# EAGLE design nanonode-xmega-mc-headers (EAGLE 5.10)
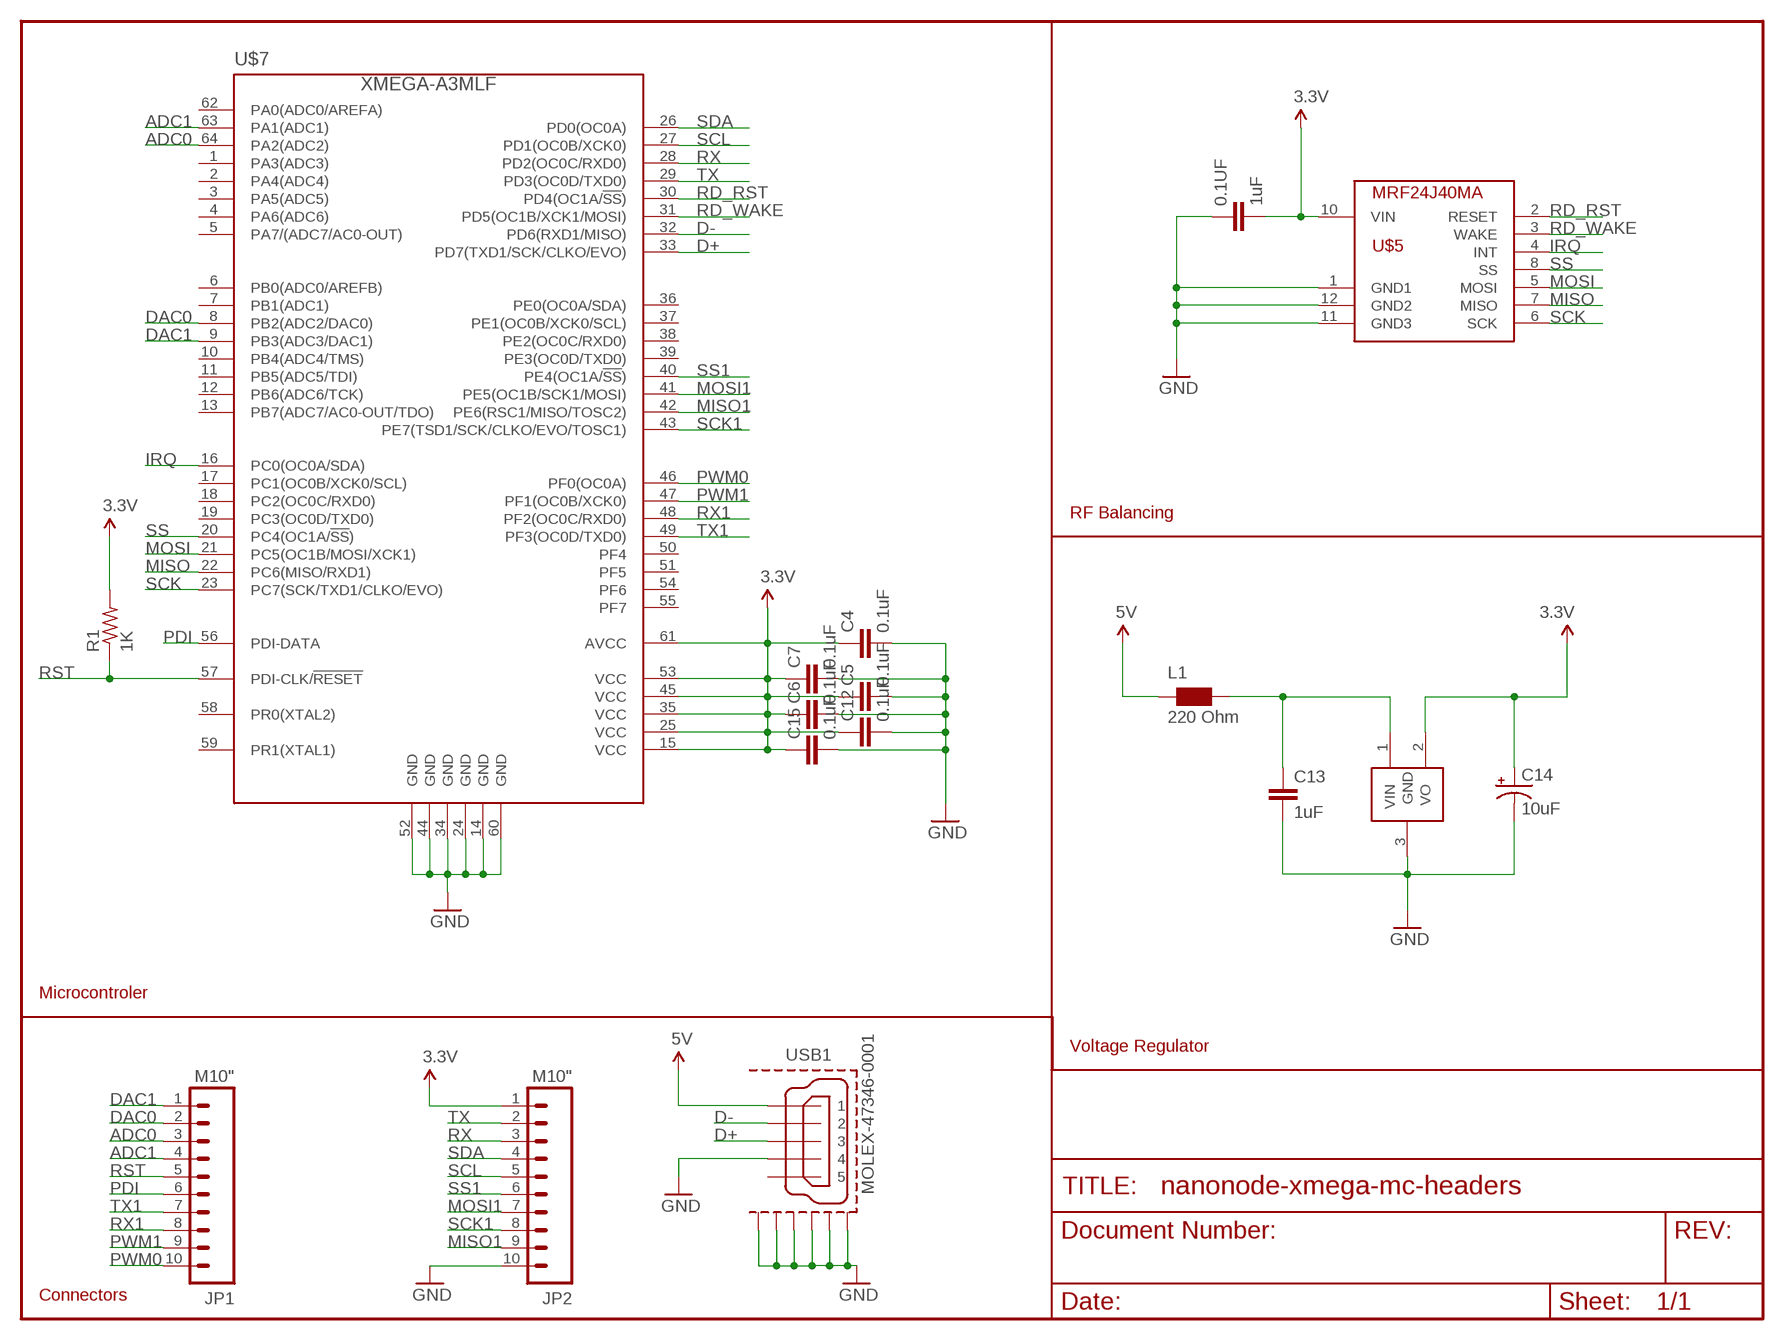
[diagram p0: schematic, sheet 1]

## Parts
0.1UF  1uF  C-EUC0603  [C0603]
C4  0.1uF  C-EUC0603  [C0603]
C5  0.1uF  C-EUC0603  [C0603]
C6  0.1uF  C-EUC0603  [C0603]
C7  0.1uF  C-EUC0603  [C0603]
C12  0.1uF  C-EUC0603  [C0603]
C13  1uF  C-EUC0603  [C0603]
C14  10uF  CAP_POL1206  [EIA3216]
C15  0.1uF  C-EUC0603  [C0603]
JP1  M10"  [1X10]
JP2  M10"  [1X10]
L1  220 Ohm  WE-CBF_0603  [0603]
R1  1K  R-US_R0402  [R0402]
U$4  MCP1700  [SOT23-3]
U$5  MRF24J40MA  [MRF24J40MA]
U$7  XMEGA-A3MLF  [MLF64]
USB1  MOLEX-47346-0001  [MOLEX-47364-0001]

## Nets
3.3V: 0.1UF.2 C4.1 C5.1 C6.1 C7.1 C12.1 C14.A(+) C15.1 JP2.1 R1.2 U$4.2(VO) U$5.10(VIN) U$7.15(VCC) U$7.25(VCC) U$7.35(VCC) U$7.45(VCC) U$7.53(VCC) U$7.61(AVCC)
5V: L1.1 USB1.1
ADC0: JP1.3 U$7.64(PA2(ADC2))
ADC1: JP1.4 U$7.63(PA1(ADC1))
D+: U$7.33(PD7(TXD1/SCK/CLKO/EVO)) USB1.3
D-: U$7.32(PD6(RXD1/MISO)) USB1.2
DAC0: JP1.2 U$7.8(PB2(ADC2/DAC0))
DAC1: JP1.1 U$7.9(PB3(ADC3/DAC1))
GND: 0.1UF.1 C4.2 C5.2 C6.2 C7.2 C12.2 C13.2 C14.C(-) C15.2 JP2.10 U$4.3(GND) U$5.1(GND1) U$5.11(GND3) U$5.12(GND2) U$7.14(GND) U$7.24(GND) U$7.34(GND) U$7.44(GND) U$7.52(GND) U$7.60(GND) USB1.4 USB1.GND1 USB1.GND2 USB1.GND3 USB1.GND4 USB1.GND5 USB1.GND6
IRQ: U$5.4(INT) U$7.16(PC0(OC0A/SDA))
MISO: U$5.7(MISO) U$7.22(PC6(MISO/RXD1))
MISO1: JP2.9 U$7.42(PE6(RSC1/MISO/TOSC2))
MOSI: U$5.5(MOSI) U$7.21(PC5(OC1B/MOSI/XCK1))
MOSI1: JP2.7 U$7.41(PE5(OC1B/SCK1/MOSI))
N$13: C13.1 L1.2 U$4.1(VIN)
PDI: JP1.6 U$7.56(PDI-DATA)
PWM0: JP1.10 U$7.46(PF0(OC0A))
PWM1: JP1.9 U$7.47(PF1(OC0B/XCK0))
RD_RST: U$5.2(RESET) U$7.30(PD4(OC1A/!SS!))
RD_WAKE: U$5.3(WAKE) U$7.31(PD5(OC1B/XCK1/MOSI))
RST: JP1.5 R1.1 U$7.57(PDI-CLK/!RESET)
RX: JP2.3 U$7.28(PD2(OC0C/RXD0))
RX1: JP1.8 U$7.48(PF2(OC0C/RXD0))
SCK: U$5.6(SCK) U$7.23(PC7(SCK/TXD1/CLKO/EVO))
SCK1: JP2.8 U$7.43(PE7(TSD1/SCK/CLKO/EVO/TOSC1))
SCL: JP2.5 U$7.27(PD1(OC0B/XCK0))
SDA: JP2.4 U$7.26(PD0(OC0A))
SS: U$5.8(SS) U$7.20(PC4(OC1A/!SS!))
SS1: JP2.6 U$7.40(PE4(OC1A/!SS!))
TX: JP2.2 U$7.29(PD3(OC0D/TXD0))
TX1: JP1.7 U$7.49(PF3(OC0D/TXD0))
Unconnected: U$7.1(PA3(ADC3)) U$7.2(PA4(ADC4)) U$7.3(PA5(ADC5)) U$7.4(PA6(ADC6)) U$7.5(PA7/(ADC7/AC0-OUT)) U$7.6(PB0(ADC0/AREFB)) U$7.7(PB1(ADC1)) U$7.10(PB4(ADC4/TMS)) U$7.11(PB5(ADC5/TDI)) U$7.12(PB6(ADC6/TCK)) U$7.13(PB7(ADC7/AC0-OUT/TDO)) U$7.17(PC1(OC0B/XCK0/SCL)) U$7.18(PC2(OC0C/RXD0)) U$7.19(PC3(OC0D/TXD0)) U$7.36(PE0(OC0A/SDA)) U$7.37(PE1(OC0B/XCK0/SCL)) U$7.38(PE2(OC0C/RXD0)) U$7.39(PE3(OC0D/TXD0)) U$7.50(PF4) U$7.51(PF5) U$7.54(PF6) U$7.55(PF7) U$7.58(PR0(XTAL2)) U$7.59(PR1(XTAL1)) U$7.62(PA0(ADC0/AREFA)) USB1.5

## Notes on the sheet
- RF Balancing
- Microcontroler
- Voltage Regulator
- Connectors

## Library data of the parts
0.1UF C4-C7 C12 C13 C15 = rcl:C-EU: CAPACITOR, European symbol
C14 = sparkfun:CAP_POL: Capacitor Polarized These are standard SMD and PTH capacitors. Normally 10uF, 47uF, and 100uF in electrolytic and tantalum varieties. Always verify the external diameter of the through hole cap, it varies with capacity, voltage, and manufacturer. The EIA devices should be standard.
JP1 JP2 = sparkfun:M10: Header 10 Standard 10-pin 0.1" header. Use with straight break away headers (SKU : PRT-00116), right angle break away headers (PRT-00553), swiss pins (PRT-00743), machine pins (PRT-00117), and female headers (PRT-00115).
L1 = wuerth-elektronik:WE-CBF: SMD EMI Suppression Ferrite Beads - excellent anti-EMI properties - low DCR - impedances till 3000 ohms - rated current up to 6 A
R1 = resistor:R-US_: RESISTOR, American symbol
U$4 = nonolith:MCP1700: Voltage regulator
U$5 = custom:MRF24J40MA
U$7 = custom:XMEGA-A3: Atmel XMega A3 series processor
USB1 = custom:MOLEX-47346-0001: MICRO USB B, BOTTOM MOUNT

## Board
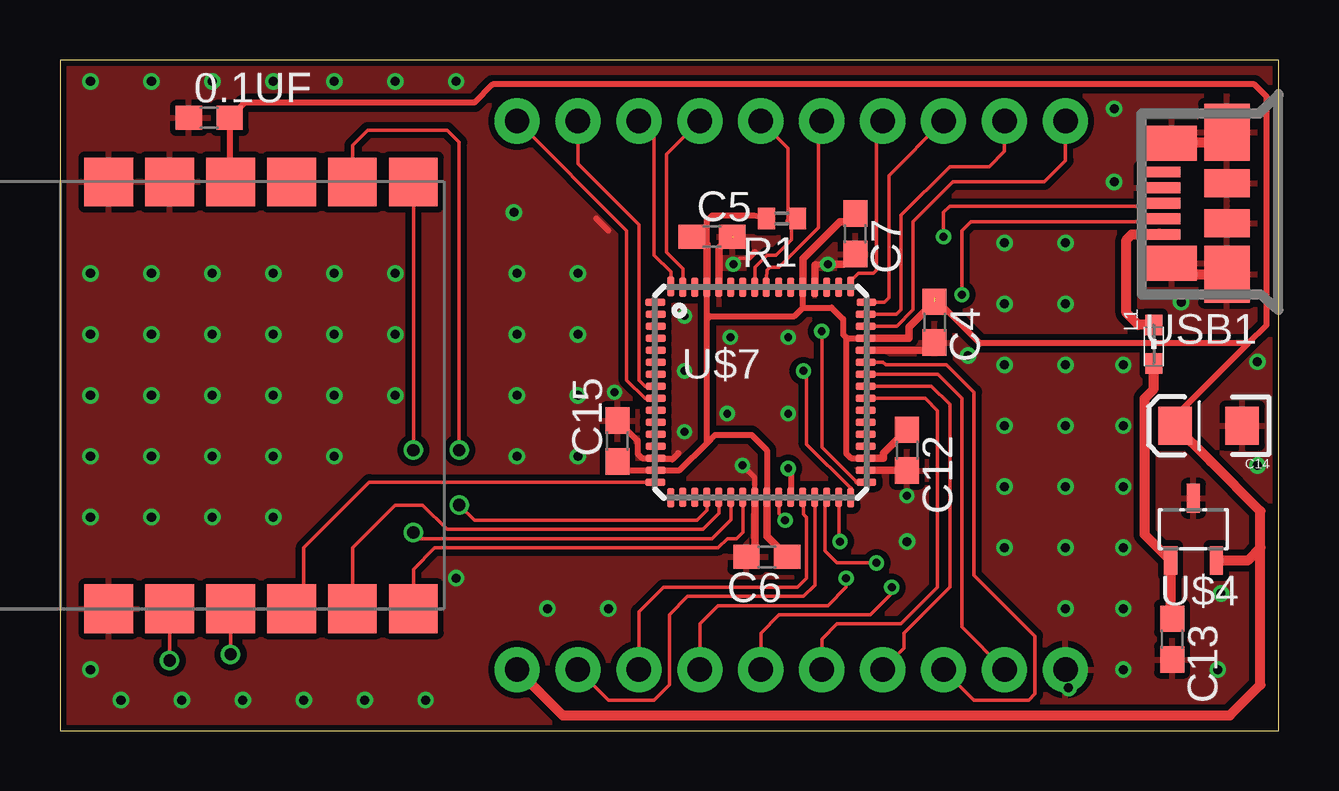
[diagram p1: board, top side]
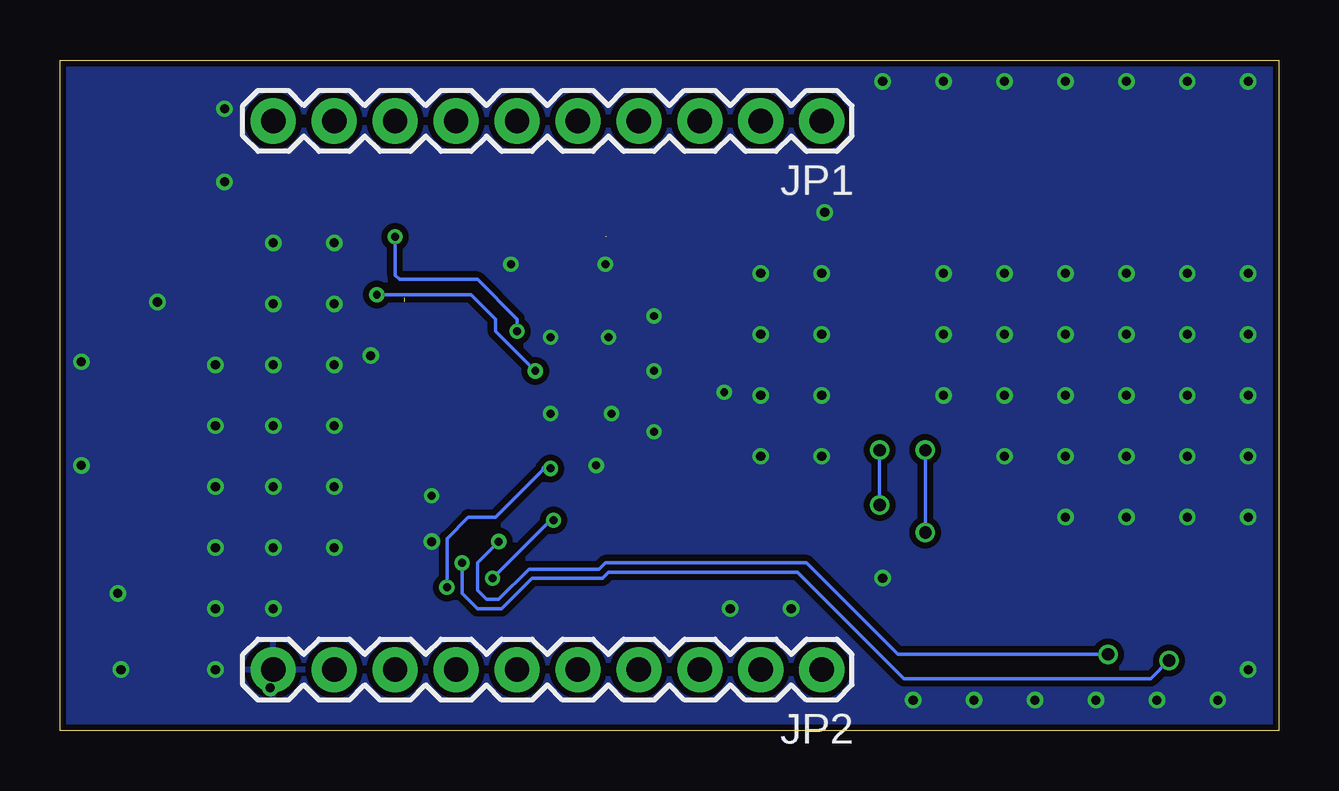
[diagram p2: board, bottom side, seen from below]

Size 50.8 x 27.94 mm. Coordinates in mm from the lower left corner, seen from the top.
Outline: 50.8,27.94 0,27.94 0,0 50.8,0 50.8,27.94
Copper layers (1*16): Top 0.035mm / dielectric 1.5mm / Bottom 0.035mm
Design rules "Fusion_eagle_rule_v1.1": minimum track width 6mil, minimum drill 12mil, track to track 6mil, track to pad 6mil, pad to pad 6mil, via to via 6mil, smd to smd 0mil, copper to edge 10mil, drill to drill 10mil, minimum pad ring 10mil, minimum via ring 6mil, stop-mask expansion 2mil, vias tented up to drill 100mil, thermal gap 10mil

### Footprints (pad centres in the part's own frame; a part is rotated, then mirrored left to right if it is on the bottom)
C0603 = smd 1.1 x 1: 1 -0.85,0; 2 0.85,0
EIA3216 = smd 1.4 x 1.6: A 1.4,0; C -1.4,0
1X10 = drill 1.016 pad 1.88 round: 1 0,0; 2 2.54,0; 3 5.08,0; 4 7.62,0; 5 10.16,0; 6 12.7,0; 7 15.24,0; 8 17.78,0; 9 20.32,0; 10 22.86,0
0603 = smd 0.85 x 0.7: 1 -0.9,0; 2 0.7,0
R0402 = smd 0.7 x 0.9: 1 -0.65,0; 2 0.65,0
SOT23-3 = smd 0.55 x 1.2: 1 0.95,1.3; 2 -0.95,1.3; 3 0,-1.3
MRF24J40MA = smd 2.032 x 2.032: 1 -13.97,0; 2 -11.43,0; 3 -8.89,0; 4 -6.35,0; 5 -3.81,0; 6 -1.27,0; 7 -1.27,17.78; 8 -3.81,17.78; 9 -6.35,17.78; 10 -8.89,17.78; 11 -11.43,17.78; 12 -13.97,17.78
MLF64 = smd 0.827 x 0.3: 1 -4.401,3.75; 2 -4.376,3.25; 3 -4.376,2.75; 4 -4.376,2.25; 5 -4.376,1.75; 6 -4.376,1.25; 7 -4.376,0.75; 8 -4.376,0.25; 9 -4.376,-0.25; 10 -4.376,-0.75; 11 -4.376,-1.25; 12 -4.376,-1.75; 13 -4.376,-2.25; 14 -4.376,-2.75; 15 -4.376,-3.25; 16 -4.401,-3.75; 33 4.401,-3.75; 34 4.376,-3.25; 35 4.376,-2.75; 36 4.376,-2.25; 37 4.376,-1.75; 38 4.376,-1.25; 39 4.376,-0.75; 40 4.376,-0.25; 41 4.376,0.25; 42 4.376,0.75; 43 4.376,1.25; 44 4.376,1.75; 45 4.376,2.25; 46 4.376,2.75; 47 4.376,3.25; 48 4.401,3.75 | smd 0.3 x 0.827: 17 -3.75,-4.401; 18 -3.25,-4.376; 19 -2.75,-4.376; 20 -2.25,-4.376; 21 -1.75,-4.376; 22 -1.25,-4.376; 23 -0.75,-4.376; 24 -0.25,-4.376; 25 0.25,-4.376; 26 0.75,-4.376; 27 1.25,-4.376; 28 1.75,-4.376; 29 2.25,-4.376; 30 2.75,-4.376; 31 3.25,-4.376; 32 3.75,-4.401; 49 3.75,4.401; 50 3.25,4.376; 51 2.75,4.376; 52 2.25,4.376; 53 1.75,4.376; 54 1.25,4.376; 55 0.75,4.376; 56 0.225,4.376; 57 -0.25,4.376; 58 -0.75,4.376; 59 -1.25,4.376; 60 -1.75,4.376; 61 -2.25,4.376; 62 -2.75,4.376; 63 -3.25,4.376; 64 -3.75,4.401
MOLEX-47364-0001 = smd 1.7 x 0.45: 1 2.8,1.3; 2 2.8,0.65; 3 2.8,0; 4 2.8,-0.65; 5 2.8,-1.3 | smd 1.9 x 2.375: GND1 0,2.95; GND4 0,-2.95 | smd 2.1 x 1.475: GND2 2.3,2.5; GND3 2.3,-2.5 | smd 1.9 x 1.175: GND5 0,-0.838; GND6 0,0.838

### Placement (x,y rotation side)
0.1UF  6.22,25.53 0 top
C4  36.45,17.02 270 top
C5  27.18,20.57 0 top
C6  29.46,7.24 180 top
C7  33.15,20.7 270 top
C12  35.31,11.68 270 top
C13  46.36,3.81 270 top
C14  47.88,12.7 180 top
C15  23.24,12.06 90 top
JP1  19.05,25.4 180 bottom
JP2  19.05,2.54 180 bottom
L1  45.59,16 270 top
R1  30.1,21.34 180 top
U$4  47.24,8.38 180 top
U$5  16,5.08 0 top
U$7  29.21,14.1 0 top
USB1  48.64,21.97 180 top

### Tracks (layer width: path | path; a pad name or v marks a point on that pad's centre or on a via)
3.3V  (1 unrouted)
  Top 0.254: U$7.25 29.46,9.78 29.46,11.68 28.83,12.32 27.3,12.32 26.96,11.97 | 26.96,11.97 26.96,17.14 | 26.96,17.14 U$7.61 | 26.96,11.97 25.83,10.85 U$7.15 23.61,10.85 C15.1 | 30.96,17.62 U$7.53 | 30.96,17.62 30.61,17.27 27.09,17.27 26.96,17.14 | 30.96,17.62 32.16,17.62 32.64,17.14 32.64,16.51 32.8,16.35 | 32.8,16.35 U$7.45 | C5.1 26.96,20.27 26.96,21.25 27.18,21.46 28.94,21.46 R1.2 | U$7.35 32.98,11.35 32.77,11.56 32.77,16.31 32.8,16.35 | C14.A 46.48,13.08 49.53,16.13 | 49.53,16.13 50.29,16.89 50.29,26.42 49.78,26.92 18.03,26.92 17.27,26.16 7.71,26.16 0.1UF.2 7.07,22.9 U$5.10 | 49.53,16.13 38.35,16.13 36.45,18.03
  Top 0.305: U$7.35 34.32,11.35 34.32,11.55 C12.1 | U$7.45 35.38,16.35 35.38,16.8 C4.1 | U$7.61 26.96,20.27 | U$7.25 29.46,8.09 C6.1 | U$7.53 30.96,19.66 32.51,21.21 32.8,21.21 C7.1
  Top 0.406: C14.A 47.96,11.22 47.97,11.22 50.04,9.14 50.04,7.62 | U$4.2 49.5,7.08 50.04,7.62 | 50.04,7.62 50.04,1.91 48.77,0.64 20.95,0.64 JP2.1
5V
  Top 0.406: 45.81,20.7 USB1.1 44.67,20.67 44.45,20.45 44.45,17.4 44.95,16.9 L1.1
ADC0
  Top 0.152: U$7.64 25.46,19.12 24.77,19.81 24.77,24.77 JP1.3
ADC1
  Top 0.152: U$7.63 25.96,19.25 25.27,19.94 25.27,24 JP1.4
D+  (via drill 0.33)
  Top 0.152: v36.83,20.57 36.83,21.59 37.08,21.84 45.71,21.84 USB1.3 | 33.21,10.35 31.75,11.81 v31.75,16.64
  Top 0.203: U$7.33 33.21,10.35
  Bottom 0.152: v31.75,16.64 31.75,17.14 33.4,18.8 36.65,18.8 36.83,18.97 v36.83,20.57
D-  (via drill 0.33)
  Top 0.152: 32.96,10.09 31.11,11.94 31.11,14.86 v30.99,14.99 | v37.59,18.16 37.59,20.83 37.97,21.21 45.73,21.21 USB1.2
  Top 0.203: U$7.32 32.96,10.09
  Bottom 0.152: v37.59,18.16 33.66,18.16 32.64,17.14 32.64,16.64 v30.99,14.99
DAC0
  Top 0.152: U$7.8 24.39,14.35 24.13,14.61 24.13,21.08 21.59,23.62 JP1.2
DAC1
  Top 0.152: U$7.9 24.38,13.85 23.62,14.61 23.62,20.83 JP1.1
GND  (via drill 0.33, 0.38)  (1 unrouted)
  Top 0.152: 28.7,19.68 28.32,19.68 v28.07,19.43
  Top 0.203: U$7.24 28.96,10.54 v28.45,11.05
  Top 0.254: C6.2 28.96,7.64 | 35.12,10.85 C12.2 | 24.61,11.35 U$7.14 24.26,11.35 24.08,11.53 24.08,12.08 C15.2 | 36.18,15.85 C4.2 | 32.65,19.43 C7.2 | 27.94,20.57 28.07,20.57 | 22.86,20.83 22.35,21.34 | 28.7,19.68 28.96,19.94 | 31.46,19.39 31.5,19.43 v32,19.43 | 24.89,11.3 25.53,11.3 25.78,11.56
  Top 0.305: 28.96,7.64 U$7.24 | U$7.34 35.12,10.85 | U$7.44 36.18,15.85 | v32,19.43 32.65,19.43 | U$7.60 27.46,20.09 27.94,20.57 | U$7.52 31.46,19.39
  Top 0.406: USB1.GND1 46.79,19.02 USB1.GND2 | 46.36,24.51 48.64,24.51
  other vias: 27.94,16.38 35.31,9.78 37.85,15.62 26.04,12.45 49.91,11.05 35.31,7.87 27.81,13.21 30.35,13.21 30.35,16.38 26.04,14.99 26.04,17.27 23.11,14.1 48.39,5.71 18.92,21.59 42.04,1.78 49.91,15.37 46.74,17.86 1.27,27.05 3.81,27.05 6.35,27.05 8.89,27.05 11.43,27.05 13.97,27.05 1.27,19.05 3.81,19.05 6.35,19.05 8.89,19.05 11.43,19.05 13.97,19.05 13.97,16.51 11.43,16.51 8.89,16.51 6.35,16.51 3.81,16.51 1.27,16.51 1.27,13.97 3.81,13.97 6.35,13.97 8.89,13.97 11.43,13.97 13.97,13.97 11.43,11.43 8.89,11.43 6.35,11.43 3.81,11.43 1.27,11.43 1.27,8.89 3.81,8.89 6.35,8.89 8.89,8.89 19.05,19.05 21.59,19.05 19.05,16.51 21.59,16.51 19.05,13.97 21.59,13.97 19.05,11.43 21.59,11.43 1.27,2.54 2.54,1.27 5.08,1.27 7.62,1.27 10.16,1.27 12.7,1.27 15.24,1.27 16.51,6.35 39.37,15.24 39.37,12.7 39.37,10.16 39.37,7.62 41.91,5.08 41.91,7.62 41.91,10.16 41.91,12.7 41.91,15.24 44.32,7.62 44.32,5.08 44.32,15.24 44.32,12.7 44.32,10.16 44.32,2.54 48.26,2.54 20.32,5.08 22.86,5.08 16.51,27.05 39.37,20.32 41.91,20.32 39.37,17.78 41.91,17.78 43.94,25.91 43.94,22.86
  pour Top (isolate 0.254): 50.8,27.94 0,27.94 0,0 50.8,0
  pour Bottom (isolate 0.254): 50.8,27.94 0,27.94 0,0 50.8,0
IRQ
  Top 0.152: U$7.16 12.89,10.35 10.16,7.62 10.16,5.59 U$5.4
MISO  (via drill 0.51)
  Top 0.152: v14.73,11.68 U$5.7 | v14.73,8.26 14.99,8 27.18,8 27.96,8.78 U$7.22
  Bottom 0.152: v14.73,8.26 v14.73,11.68
MISO1
  Top 0.152: U$7.42 36.59,14.85 37.59,13.84 37.59,4.32 JP2.9
MOSI
  Top 0.152: U$7.21 27.46,9.04 26.8,8.38 16.13,8.38 15.11,9.4 13.97,9.4 12.19,7.62 U$5.5
MOSI1
  Top 0.152: U$7.41 36.33,14.35 37.08,13.59 37.08,5.97 35.18,4.06 35.18,3.43 JP2.7
N$13
  Top 0.406: L1.2 45.59,14.22 45.21,13.84 45.21,8.16 U$4.1 46.29,4.72 C13.1
PDI
  Top 0.152: U$7.56 29.46,19.17 29.59,19.3 29.97,19.3 31.62,20.95 31.62,25.27 JP1.6
PWM0
  Top 0.152: U$7.46 34.88,16.85 35.56,17.53 35.56,21.21 37.21,22.86 41.02,22.86 41.91,23.75 JP1.10
PWM1
  Top 0.152: U$7.47 34.87,17.35 35.05,17.53 35.05,21.46 37.08,23.5 38.74,23.5 39.37,24.13 JP1.9
RD_RST  (via drill 0.33, 0.51)
  Top 0.152: U$7.30 31.88,9.64 31.88,7.49 32.38,6.99 v34.04,6.99 | v4.57,2.92 U$5.2
  Bottom 0.152: v34.04,6.99 34.04,5.71 33.4,5.08 32.38,5.08 31.11,6.35 28.19,6.35 27.94,6.6 20.07,6.6 15.62,2.16 5.33,2.16 v4.57,2.92
RD_WAKE  (via drill 0.33, 0.51)
  Top 0.152: 32.46,7.93 U$7.31 | v7.11,3.17 U$5.3
  Top 0.254: v32.51,7.87 32.46,7.93
  Bottom 0.152: v32.51,7.87 33.4,6.99 33.4,5.84 33.02,5.46 32.51,5.46 31.24,6.73 28.32,6.73 28.07,6.99 19.68,6.99 15.88,3.17 v7.11,3.17
RST
  Top 0.152: U$7.57 28.96,19.31 29.46,19.81 29.84,19.81 30.48,20.45 30.48,21.22 | 30.35,21.22 30.35,24.26 JP1.5
  Top 0.254: 30.48,21.22 R1.1 30.35,21.22
RX
  Top 0.152: U$7.28 30.99,9.69 30.99,9.02 31.11,8.89 31.11,6.35 30.73,5.97 25.15,5.97 24.13,4.95 JP2.3
RX1
  Top 0.152: U$7.48 34.36,17.85 34.54,18.03 34.54,23.11 JP1.8
SCK
  Top 0.152: 28.45,9.76 U$7.23 28.46,8.27 28.19,8 27.81,8 27.43,7.62 15.62,7.62 14.73,6.73 U$5.6
SCK1
  Top 0.152: U$7.43 34.31,15.35 34.42,15.24 36.96,15.24 38.1,14.1 38.1,6.48 40.64,3.94 40.64,1.52 40.39,1.27 38.1,1.27 JP2.8
SCL  (via drill 0.33)
  Top 0.152: v34.67,5.97 34.67,5.71 33.78,4.83 29.97,4.83 29.21,4.06 JP2.5
  Top 0.254: U$7.27 30.46,10.81 v30.35,10.92
  Bottom 0.152: 30.61,10.92 32.64,8.89 33.78,8.89 34.67,8 v34.67,5.97
  Bottom 0.254: 30.61,10.92 v30.35,10.92
SDA  (via drill 0.33)
  Top 0.152: U$7.26 29.96,9.03 v30.23,8.76 | v32.77,6.35 32.77,5.97 32,5.21 27.43,5.21 26.67,4.45 JP2.4
  Bottom 0.152: v32.77,6.35 30.35,8.76
  Bottom 0.254: 30.35,8.76 v30.23,8.76
SS  (via drill 0.51)
  Top 0.152: U$7.20 26.96,9.18 26.54,8.76 17.27,8.76 v16.64,9.4 | v16.64,11.68 16.64,24.51 16.13,25.02 12.83,25.02 12.19,24.38 U$5.8
  Bottom 0.152: v16.64,9.4 v16.64,11.68
SS1
  Top 0.152: U$7.40 36.06,13.85 36.58,13.34 36.58,5.97 35.05,4.45 32.38,4.45 31.75,3.81 JP2.6
TX
  Top 0.152: U$7.29 31.46,6.06 30.99,5.59 26.16,5.59 25.4,4.83 25.4,1.91 24.77,1.27 22.86,1.27 JP2.2
TX1
  Top 0.152: U$7.49 32.96,18.74 33.27,19.05 33.91,19.05 34.04,19.18 34.04,25.15 JP1.7